# EAGLE design 50mil_5x2_JTAG_to_100mil_5_wire_v20 (EAGLE 7.1.0)
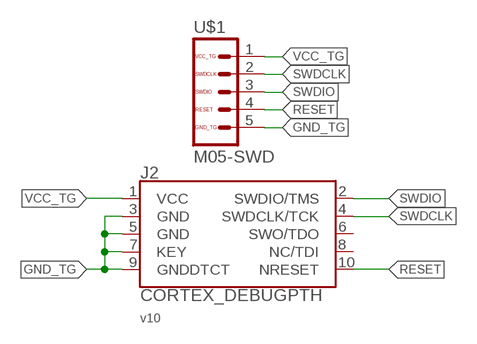
[diagram p0: schematic, sheet 1]

## Parts
J2  CORTEX_DEBUGPTH  [2X5-PTH-1.27MM]
U$1  M05-SWD  [1X05_SWD_5_WIRE]

## Nets
GND_TG: J2.3(GND) J2.5(GND) J2.7(KEY) J2.9(GNDDTCT) U$1.5
RESET: J2.10(NRESET) U$1.4
SWDCLK: J2.4(SWDCLK/TCK) U$1.2
SWDIO: J2.2(SWDIO/TMS) U$1.3
VCC_TG: J2.1(VCC) U$1.1
Unconnected: J2.6(SWO/TDO) J2.8(NC/TDI)

## Notes on the sheet
- v10

## Library data of the parts
J2 = SparkFun-Connectors:CORTEX_DEBUG: Cortex Debug Connector Datasheet <http://infocenter.arm.com/help/topic/com.arm.doc.faqs/attached/13634/cortex_debug_connectors.pdf>
U$1 = Testing:M05-SWD

## Board
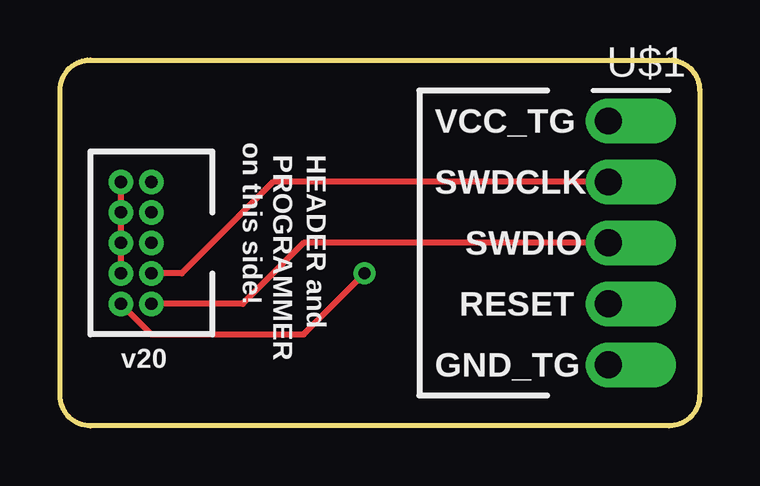
[diagram p1: board, top side]
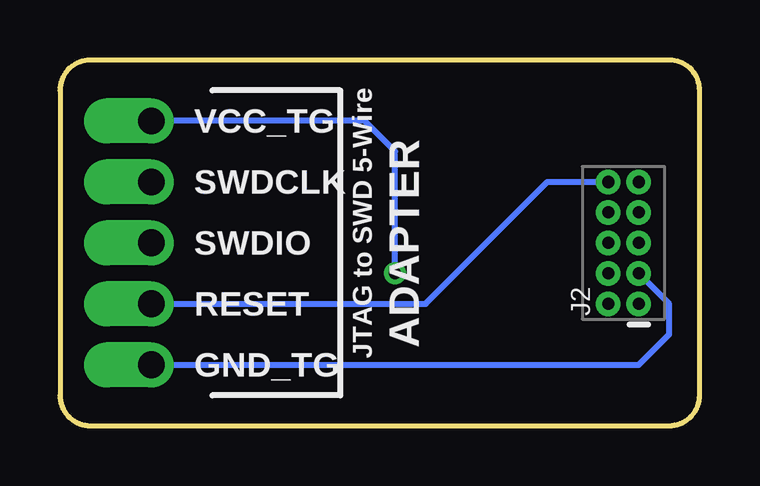
[diagram p2: board, bottom side, seen from below]

Size 26.67 x 15.24 mm. Coordinates in mm from the lower left corner, seen from the top.
Outline: 0,13.97 arc-90 1.27,15.24 25.4,15.24 arc-90 26.67,13.97 26.67,1.27 arc-90 25.4,0 1.27,0 arc-90 0,1.27 0,13.97
Copper layers (1*16): Top 0.035mm / dielectric 1.5mm / Bottom 0.035mm
Design rules "default": minimum track width 10mil, minimum drill 0.6mm, track to track 8mil, track to pad 8mil, pad to pad 8mil, via to via 8mil, smd to smd 8mil, copper to edge 40mil, drill to drill 8mil, minimum pad ring 10mil, minimum via ring 8mil, stop-mask expansion 4mil, vias tented up to drill 0mil, thermal gap 10mil

### Footprints (pad centres in the part's own frame; a part is rotated, then mirrored left to right if it is on the bottom)
2X5-PTH-1.27MM = drill 0.508 pad 1: 1 -2.54,-0.635; 2 -2.54,0.635; 3 -1.27,-0.635; 4 -1.27,0.635; 5 0,-0.635; 6 0,0.635; 7 1.27,-0.635; 8 1.27,0.635; 9 2.54,-0.635; 10 2.54,0.635
1X05_SWD_5_WIRE = drill 1.118 pad 1.88 offset: 1 0,0; 2 0,-2.54; 3 0,-5.08; 4 0,-7.62; 5 0,-10.16

### Placement (x,y rotation side)
J2  3.17,7.62 90 bottom
U$1  22.86,12.7 0 top

### Tracks (layer width: path | path; a pad name or v marks a point on that pad's centre or on a via)
GND_TG
  Top 0.254: J2.9 J2.7 J2.5 J2.3
  Bottom 0.254: U$1.5 2.54,2.54 1.27,3.81 1.27,5.08 J2.3
RESET
  Bottom 0.254: U$1.4 11.43,5.08 6.35,10.16 J2.10
SWDCLK
  Top 0.254: U$1.2 8.89,10.16 5.08,6.35 J2.4
SWDIO
  Top 0.254: U$1.3 10.16,7.62 7.62,5.08 J2.2
VCC_TG  (via drill 0.51)
  Top 0.254: J2.1 3.81,3.81 10.16,3.81 v12.7,6.35
  Bottom 0.254: v12.7,6.35 12.7,11.43 13.97,12.7 U$1.1

### Text on the board
tPlace: on this side! | VCC_TG | PROGRAMMER | HEADER and | SWDCLK | SWDIO | RESET | v20 | GND_TG
bPlace: JTAG to SWD 5-Wire | ADAPTER | VCC_TG | SWDCLK | SWDIO | RESET | GND_TG